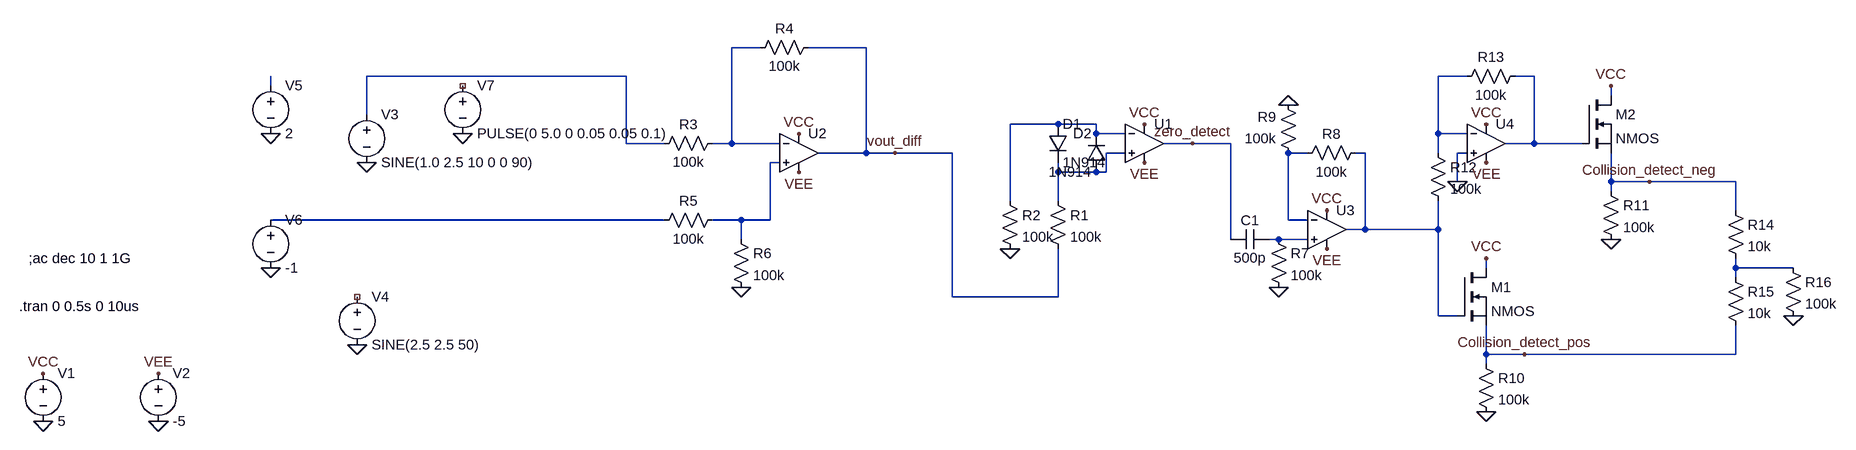
[diagram p0: schematic analog-vg-circuit-stabber-protov1-onlycollisiondetect.asc]
analog-vg-circuit-stabber-protov1-onlycollisiondetect.asc, the LTspice schematic file:
Version 4
SHEET 1 5856 1764
WIRE 3936 128 3888 128
WIRE 4112 128 4016 128
WIRE 3712 176 3280 176
WIRE 5232 176 5184 176
WIRE 5344 176 5312 176
WIRE 3120 192 3120 176
WIRE 5472 208 5472 192
WIRE 3280 240 3280 176
WIRE 4432 256 4352 256
WIRE 4496 256 4432 256
WIRE 4496 272 4496 256
WIRE 4544 272 4496 272
WIRE 5184 272 5184 176
WIRE 5232 272 5184 272
WIRE 3712 288 3712 176
WIRE 3776 288 3712 288
WIRE 3888 288 3888 128
WIRE 3888 288 3856 288
WIRE 3968 288 3888 288
WIRE 4656 288 4608 288
WIRE 4720 288 4656 288
WIRE 5344 288 5344 176
WIRE 5344 288 5296 288
WIRE 5424 288 5344 288
WIRE 4112 304 4112 128
WIRE 4112 304 4032 304
WIRE 4160 304 4112 304
WIRE 4256 304 4160 304
WIRE 4544 304 4512 304
WIRE 4848 304 4816 304
WIRE 4944 304 4928 304
WIRE 5184 304 5184 272
WIRE 5232 304 5216 304
WIRE 3968 320 3952 320
WIRE 4432 336 4432 320
WIRE 4496 336 4432 336
WIRE 4512 336 4512 304
WIRE 4512 336 4496 336
WIRE 5216 352 5216 304
WIRE 5472 352 5472 304
WIRE 5536 352 5472 352
WIRE 5680 352 5536 352
WIRE 5472 368 5472 352
WIRE 4352 384 4352 256
WIRE 4432 384 4432 336
WIRE 5680 400 5680 352
WIRE 3776 416 3120 416
WIRE 3904 416 3856 416
WIRE 3952 416 3952 320
WIRE 3952 416 3904 416
WIRE 4816 416 4816 304
WIRE 4848 416 4816 416
WIRE 4944 432 4944 304
WIRE 4944 432 4912 432
WIRE 5184 432 5184 384
WIRE 5184 432 4944 432
WIRE 3904 448 3904 416
WIRE 4720 448 4720 288
WIRE 4800 448 4784 448
WIRE 4848 448 4800 448
WIRE 5264 496 5264 480
WIRE 5680 496 5680 480
WIRE 5776 496 5680 496
WIRE 5680 512 5680 496
WIRE 4256 544 4256 304
WIRE 4432 544 4432 464
WIRE 4432 544 4256 544
WIRE 5184 576 5184 432
WIRE 5216 576 5184 576
WIRE 5264 640 5264 592
WIRE 5328 640 5264 640
WIRE 5680 640 5680 592
WIRE 5680 640 5328 640
WIRE 5264 656 5264 640
FLAG 4000 272 VCC
FLAG 4000 336 VEE
FLAG 2496 752 0
FLAG 2304 672 VCC
FLAG 2304 752 0
FLAG 2496 672 VEE
FLAG 4160 304 vout_diff
FLAG 3264 624 0
FLAG 3280 320 0
FLAG 3904 528 0
FLAG 3120 272 0
FLAG 3120 496 0
FLAG 4352 464 0
FLAG 4576 256 VCC
FLAG 3440 272 0
FLAG 4656 288 zero_detect
FLAG 4576 320 VEE
FLAG 4880 400 VCC
FLAG 4880 464 VEE
FLAG 4800 528 0
FLAG 4816 224 0
FLAG 5264 480 VCC
FLAG 5264 736 0
FLAG 5328 640 Collision_detect_pos
FLAG 5472 192 VCC
FLAG 5472 448 0
FLAG 5536 352 Collision_detect_neg
FLAG 5216 352 0
FLAG 5264 256 VCC
FLAG 5264 320 VEE
FLAG 5776 576 0
SYMBOL Opamps\\UniversalOpamp2 4000 304 R0
SYMATTR InstName U2
SYMBOL voltage 2496 656 R0
WINDOW 123 0 0 Left 2
WINDOW 39 0 0 Left 2
SYMATTR InstName V2
SYMATTR Value -5
SYMBOL voltage 2304 656 R0
WINDOW 123 0 0 Left 2
WINDOW 39 0 0 Left 2
SYMATTR InstName V1
SYMATTR Value 5
SYMBOL res 4032 112 R90
WINDOW 0 0 56 VBottom 2
WINDOW 3 32 56 VTop 2
SYMATTR InstName R4
SYMATTR Value 100k
SYMBOL voltage 3280 224 R0
WINDOW 123 0 0 Left 2
WINDOW 39 0 0 Left 2
SYMATTR InstName V3
SYMATTR Value SINE(1.0 2.5 10 0 0 90)
SYMBOL voltage 3264 528 R0
WINDOW 123 0 0 Left 2
WINDOW 39 0 0 Left 2
SYMATTR InstName V4
SYMATTR Value SINE(2.5 2.5 50)
SYMBOL res 3872 272 R90
WINDOW 0 0 56 VBottom 2
WINDOW 3 32 56 VTop 2
SYMATTR InstName R3
SYMATTR Value 100k
SYMBOL res 3872 400 R90
WINDOW 0 0 56 VBottom 2
WINDOW 3 32 56 VTop 2
SYMATTR InstName R5
SYMATTR Value 100k
SYMBOL res 3888 432 R0
SYMATTR InstName R6
SYMATTR Value 100k
SYMBOL voltage 3120 176 R0
WINDOW 123 0 0 Left 2
WINDOW 39 0 0 Left 2
SYMATTR InstName V5
SYMATTR Value 2
SYMBOL voltage 3120 400 R0
WINDOW 123 0 0 Left 2
WINDOW 39 0 0 Left 2
SYMATTR InstName V6
SYMATTR Value -1
SYMBOL Opamps\\UniversalOpamp2 4576 288 R0
SYMATTR InstName U1
SYMBOL res 4416 368 R0
SYMATTR InstName R1
SYMATTR Value 100k
SYMBOL res 4336 368 R0
SYMATTR InstName R2
SYMATTR Value 100k
SYMBOL diode 4416 256 R0
SYMATTR InstName D1
SYMATTR Value 1N914
SYMBOL diode 4512 336 R180
WINDOW 0 24 64 Left 2
WINDOW 3 24 0 Left 2
SYMATTR InstName D2
SYMATTR Value 1N914
SYMBOL voltage 3440 176 R0
WINDOW 123 0 0 Left 2
WINDOW 39 0 0 Left 2
SYMATTR InstName V7
SYMATTR Value PULSE(0 5.0 0 0.05 0.05 0.1)
SYMBOL Opamps\\UniversalOpamp2 4880 432 R0
SYMATTR InstName U3
SYMBOL cap 4784 432 R90
WINDOW 0 0 32 VBottom 2
WINDOW 3 32 32 VTop 2
SYMATTR InstName C1
SYMATTR Value 500p
SYMBOL res 4784 432 R0
SYMATTR InstName R7
SYMATTR Value 100k
SYMBOL res 4944 288 R90
WINDOW 0 0 56 VBottom 2
WINDOW 3 32 56 VTop 2
SYMATTR InstName R8
SYMATTR Value 100k
SYMBOL res 4832 320 R180
WINDOW 0 36 76 Left 2
WINDOW 3 36 40 Left 2
SYMATTR InstName R9
SYMATTR Value 100k
SYMBOL nmos 5216 496 R0
SYMATTR InstName M1
SYMBOL res 5248 640 R0
SYMATTR InstName R10
SYMATTR Value 100k
SYMBOL Opamps\\UniversalOpamp2 5264 288 R0
SYMATTR InstName U4
SYMBOL res 5456 352 R0
SYMATTR InstName R11
SYMATTR Value 100k
SYMBOL nmos 5424 208 R0
SYMATTR InstName M2
SYMBOL res 5168 288 R0
SYMATTR InstName R12
SYMATTR Value 100k
SYMBOL res 5328 160 R90
WINDOW 0 0 56 VBottom 2
WINDOW 3 32 56 VTop 2
SYMATTR InstName R13
SYMATTR Value 100k
SYMBOL res 5664 384 R0
SYMATTR InstName R14
SYMATTR Value 10k
SYMBOL res 5664 496 R0
SYMATTR InstName R15
SYMATTR Value 10k
SYMBOL res 5760 480 R0
SYMATTR InstName R16
SYMATTR Value 100k
TEXT 2264 560 Left 2 !.tran 0 0.5s 0 10us
TEXT 2280 480 Left 2 !;ac dec 10 1 1G

The netlist it stands for:
* analog-vg-circuit-stabber-protov1-onlycollisiondetect.asc
XU2 N010 N001 VCC VEE vout_diff level.2 Avol=1Meg GBW=10Meg Slew=10Meg ilimit=25m rail=0 Vos=0 phimargin=45 en=0 enk=0 in=0 ink=0 Rin=500Meg  ; pins IN+ IN- V+ V- OUT
V2 VEE 0 -5
V1 VCC 0 5
R4 vout_diff N001 100k
V3 N002 0 SINE(1.0 2.5 10 0 0 90)
V4 NC_01 0 SINE(2.5 2.5 50)
R3 N001 N002 100k
R5 N010 N011 100k
R6 N010 0 100k
V5 N005 0 2
V6 N011 0 -1
XU1 N007 N006 VCC VEE zero_detect level.2 Avol=1Meg GBW=10Meg Slew=10Meg ilimit=25m rail=0 Vos=0 phimargin=45 en=0 enk=0 in=0 ink=0 Rin=500Meg  ; pins IN+ IN- V+ V- OUT
R1 N007 vout_diff 100k
R2 N006 0 100k
D1 N006 N007 1N914
D2 N007 N006 1N914
V7 NC_02 0 PULSE(0 5.0 0 0.05 0.05 0.1)
XU3 N012 N008 VCC VEE N009 level.2 Avol=1Meg GBW=10Meg Slew=10Meg ilimit=25m rail=0 Vos=0 phimargin=45 en=0 enk=0 in=0 ink=0 Rin=500Meg  ; pins IN+ IN- V+ V- OUT
C1 N012 zero_detect 500p
R7 N012 0 100k
R8 N009 N008 100k
R9 N008 0 100k
M1 VCC N009 Collision_detect_pos Collision_detect_pos NMOS
R10 Collision_detect_pos 0 100k
XU4 0 N003 VCC VEE N004 level.2 Avol=1Meg GBW=10Meg Slew=10Meg ilimit=25m rail=0 Vos=0 phimargin=45 en=0 enk=0 in=0 ink=0 Rin=500Meg  ; pins IN+ IN- V+ V- OUT
R11 Collision_detect_neg 0 100k
M2 VCC N004 Collision_detect_neg Collision_detect_neg NMOS
R12 N003 N009 100k
R13 N004 N003 100k
R14 Collision_detect_neg N013 10k
R15 N013 Collision_detect_pos 10k
R16 N013 0 100k
.model D D
.lib standard.dio
.model NMOS NMOS
.model PMOS PMOS
.lib standard.mos
.tran 0 0.5s 0 10us
;ac dec 10 1 1G
.lib UniversalOpamps2.sub
.backanno
.end